# EAGLE design half-pint-turbidimeter_controls_2.0.1 (EAGLE 7.2.0)
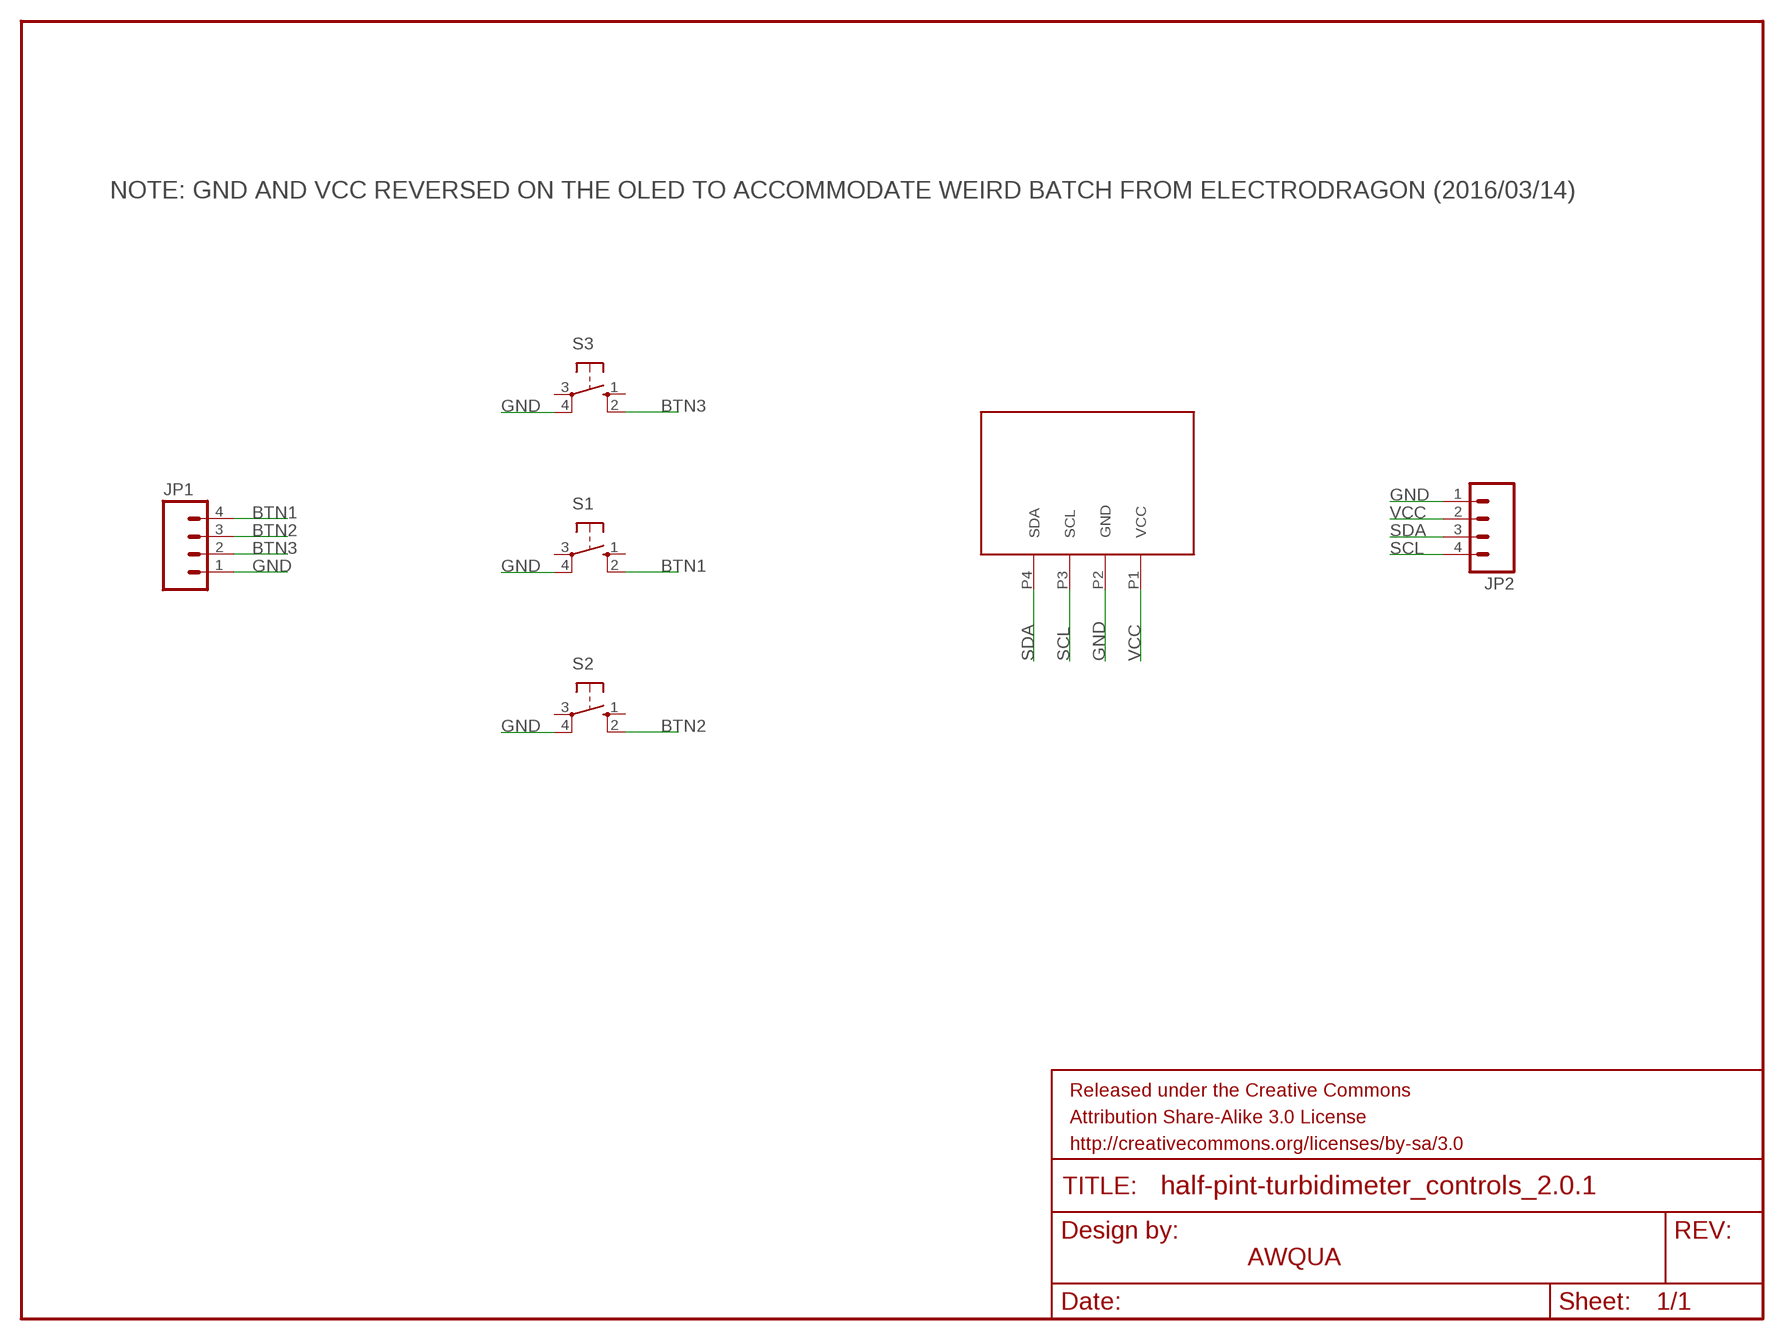
[diagram p0: schematic, sheet 1]

## Parts
FRAME1  FRAME-LETTER  [CREATIVE_COMMONS]
JP1  M04PTH  [1X04]
JP2  M04PTH  [1X04]
S1  40-XX  [B3F-40XX]
S2  40-XX  [B3F-40XX]
S3  40-XX  [B3F-40XX]
U$2  I2C-OLED-096  [I2C-OLED-096]

## Nets
BTN1: JP1.4 S1.2(S1)
BTN2: JP1.3 S2.2(S1)
BTN3: JP1.2 S3.2(S1)
GND: JP1.1 JP2.1 S1.4(P1) S2.4(P1) S3.4(P1) U$2.P2(GND)
SCL: JP2.4 U$2.P3(SCL)
SDA: JP2.3 U$2.P4(SDA)
VCC: JP2.2 U$2.P1(VCC)
Unconnected: S1.1(S) S1.3(P) S2.1(S) S2.3(P) S3.1(S) S3.3(P)

## Notes on the sheet
- NOTE: GND AND VCC REVERSED ON THE OLED TO ACCOMMODATE WEIRD BATCH FROM ELECTRODRAGON (2016/03/14)
- AWQUA

## Library data of the parts
FRAME1 = SparkFun-Aesthetics:FRAME-LETTER: Schematic Frame Standard 8.5x11 US Letter frame
JP1 JP2 = SparkFun-Connectors:M04: Header 4 Standard 4-pin 0.1" header. Use with straight break away headers (SKU : PRT-00116), right angle break away headers (PRT-00553), swiss pins (PRT-00743), machine pins (PRT-00117), and female headers (PRT-00115). Molex polarized connector foot print use with SKU : PRT-08231 with associated crimp pins and housings. 1MM SMD Version SKU: PRT-10208
S1-S3 = adafruit:40-XX: OMRON SWITCH; MF: OMRON COMPONENTS USA; MPN: B3F-4000; OC_FARNELL: 176434; OC_NEWARK: 36K3105
U$2 = awqua_eagle_library:I2C-OLED-096

## Board
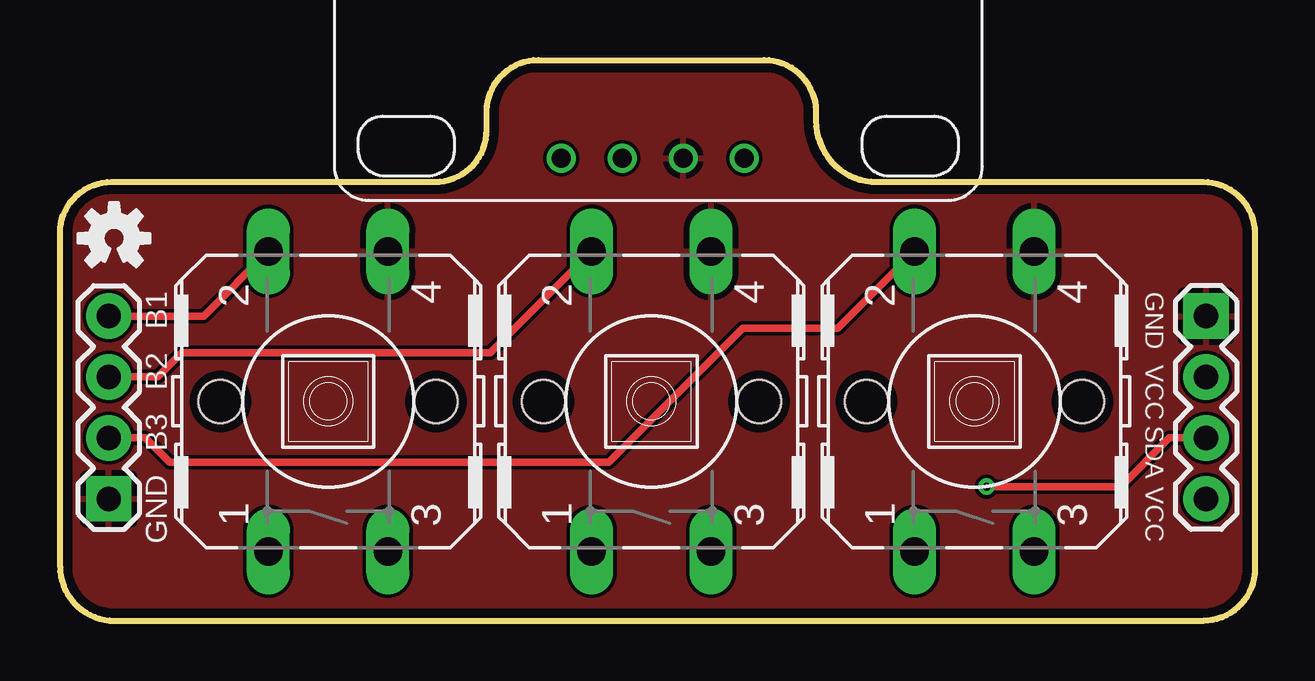
[diagram p1: board, top side]
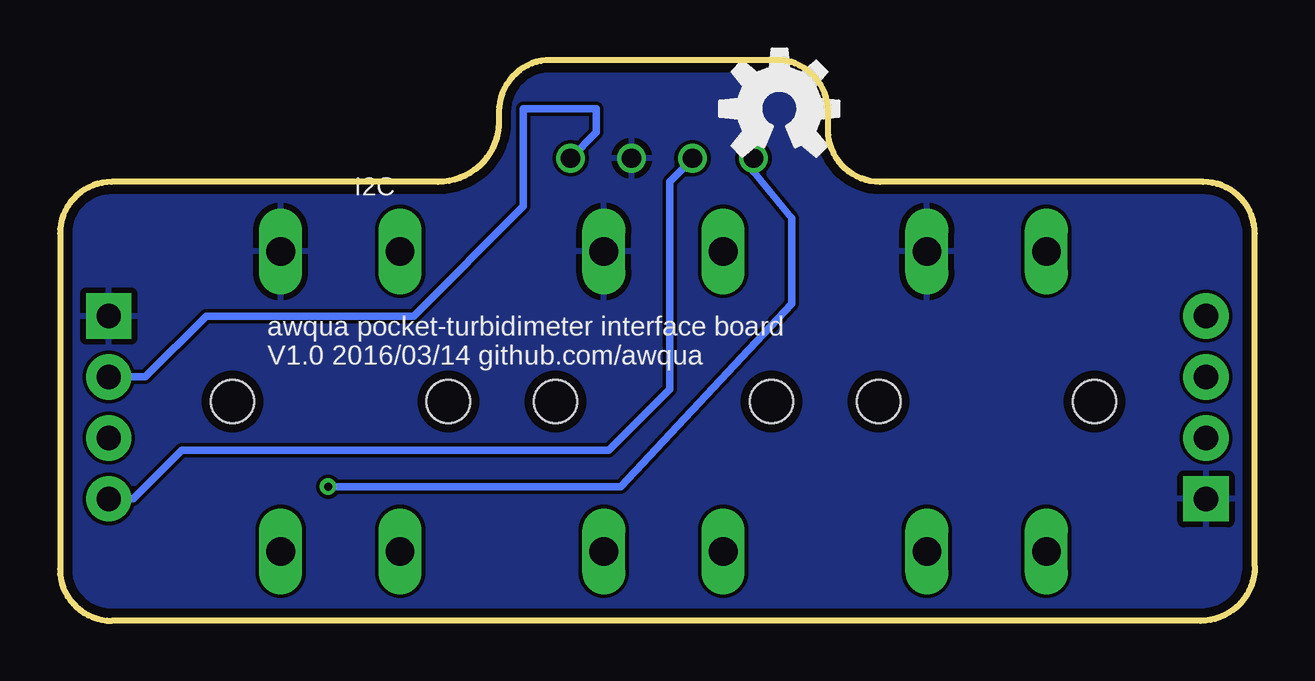
[diagram p2: board, bottom side, seen from below]

Size 49.78 x 23.37 mm. Coordinates in mm from the lower left corner, seen from the top.
Outline: 17.78,20.44 17.78,21.21 arc-90 19.93,23.37 29.34,23.37 arc-90 31.5,21.21 31.5,20.83 arc90 34.04,18.29 47.63,18.29 arc-90 49.78,16.13 49.78,2.15 arc-90 47.63,0 2.27,0 arc-90 0,2.27 0,16.13 arc-90 2.15,18.29 15.62,18.29 arc90 17.78,20.44
Copper layers (1*16): Top 0.0356mm / dielectric 1.5011mm / Bottom 0.0356mm
Design rules "default *": minimum track width 6mil, minimum drill 13mil, track to track 6mil, track to pad 6mil, pad to pad 6mil, via to via 6mil, smd to smd 6mil, copper to edge 15mil, drill to drill 6mil, minimum pad ring 7mil, minimum via ring 7mil, stop-mask expansion 4mil, vias tented up to drill 15mil, thermal gap 10mil

### Footprints (pad centres in the part's own frame; a part is rotated, then mirrored left to right if it is on the bottom)
1X04 = drill 1.016 pad 1.88 square: 1 0,0 | drill 1.016 pad 1.88: 2 2.54,0; 3 5.08,0; 4 7.62,0
B3F-40XX = drill 1.194 long: 1 -6.248,2.489; 2 6.248,2.489; 3 -6.248,-2.489; 4 6.248,-2.489 | hole 1.803: 0,-4.496; 0,4.496
I2C-OLED-096 = drill 0.8: P1 9.59,24.92; P2 12.13,24.92; P3 14.67,24.92; P4 17.21,24.92

### Placement (x,y rotation side)
FRAME1  20.95,-7.62 0 top  (outside the outline)
JP1  2.03,5.08 90 top
JP2  47.75,12.7 270 top
S1  11.18,9.14 90 top
S2  24.64,9.14 90 top
S3  38.1,9.14 90 top
U$1  [OSHW-LOGO-S]  2.25,15.94 0 top
U$2  38.1,44.2 180 top
U$4  [OSHW-LOGO-M]  19.81,21.34 0 bottom

### Tracks (layer width: path | path; a pad name or v marks a point on that pad's centre or on a via)
BTN1
  Top 0.305: JP1.4 5.99,12.7 S1.2
BTN2
  Top 0.305: JP1.3 4.06,10.16 5.08,11.18 17.93,11.18 S2.2
BTN3
  Top 0.305: JP1.2 3.56,7.62 4.57,6.6 22.86,6.6 28.45,12.19 32.41,12.19 S3.2
GND
  pour Top: -1.52,26.67 50.8,26.92 50.8,-0.76 -1.52,-1.02
  pour Bottom: -0.51,26.16 50.55,26.42 50.29,-0.76 -1.02,-0.25
SCL
  Bottom 0.305: U$2.P3 23.43,19.24 24.38,18.29 24.38,9.65 26.92,7.11 44.7,7.11 46.74,5.08 JP2.4
SDA  (via drill 0.33)
  Top 0.305: v38.61,5.59 44.2,5.59 46.23,7.62 JP2.3
  Bottom 0.305: U$2.P4 20.89,18.73 19.3,16.76 19.3,13.21 26.42,5.59 v38.61,5.59
VCC
  Bottom 0.305: JP2.2 46.23,10.16 43.69,12.7 35.05,12.7 30.48,17.27 30.48,21.34 27.43,21.34 27.43,20.35 U$2.P1

### Text on the board
bPlace: awqua pocket-turbidimeter interface board / V1.0 2016/03/14 github.com/awqua
tNames: B1 | GND | B2 | VCC | B3 | SDA | GND | VCC
bNames: I2C